# Altium schematic sheet Чертёж.SchDoc
size A4; SheetNumber: 1; SheetTotal: 1
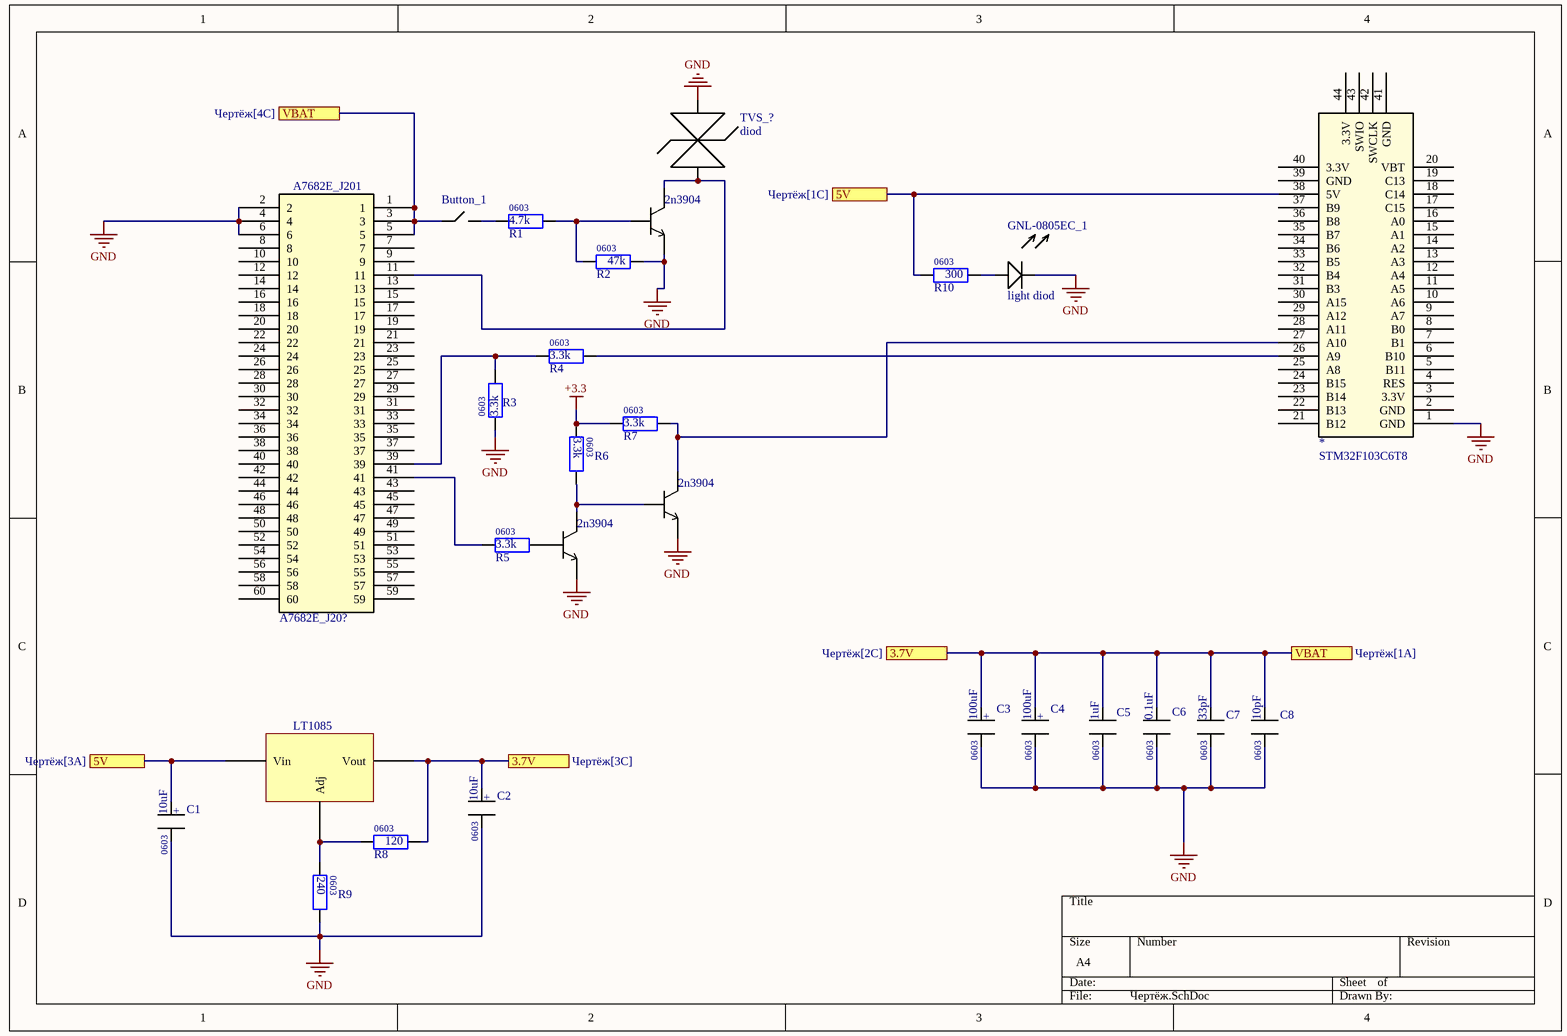
[diagram p0: Чертёж.SchDoc]

## Parts
2n3904_1  2n3904  (value not drawn)
2n3904_2  2n3904  (value not drawn)
2n3904_3  2n3904  (value not drawn)
*  STM32F103C6T8
A7682E_J201  A7682E_J20?
Button_1  Button  (value not drawn)
C1  capacitor  (value not drawn)
C2  capacitor  (value not drawn)
C3  capacitor  (value not drawn)
C4  capacitor  (value not drawn)
C5  capacitor  (value not drawn)
C6  capacitor  (value not drawn)
C7  CC060333pF  (value not drawn)
C8  capacitor  (value not drawn)
GNL-0805EC_1  light diod
LT1085_?  LT1085
R1  Resistor  (value not drawn)
R2  Resistor  (value not drawn)
R3  Resistor  (value not drawn)
R4  Resistor  (value not drawn)
R5  Resistor  (value not drawn)
R6  Resistor  (value not drawn)
R7  Resistor  (value not drawn)
R8  Resistor  (value not drawn)
R9  Resistor  (value not drawn)
R10  Resistor  (value not drawn)
TVS_?  diod

## Ports
3.7V (see Чертёж[2C]), 3.7V (see Чертёж[3C]), 5V (see Чертёж[1C]), 5V (see Чертёж[3A]), VBAT (see Чертёж[1A]), VBAT (see Чертёж[4C])

## Nets
+3.3: R6.0 R7.0
GND: 2n3904_1.6 2n3904_2.6 2n3904_3.6 *.1(GND) A7682E_J201.2 A7682E_J201.4 A7682E_J201.6 C1.3 C2.3 C3.3 C4.3 C5.3 C6.3 C7.3 C8.3 GNL-0805EC_1.?2 R2.1 R3.0 R9.1 TVS_?.?2
3.7V: A7682E_J201.1 A7682E_J201.3 A7682E_J201.5 Button_1.?1 C2.2 C3.2 C4.2 C5.2 C6.2 C7.2 C8.2 LT1085_?.?1(Vout) R8.1 ; port 3.7V, port VBAT
5V: *.38(5V) C1.2 LT1085_?.?3(Vin) R10.0 ; port 5V
Net2n3904_1_4: 2n3904_1.4 R1.1 R2.0
Net2n3904_1_5: 2n3904_1.5 A7682E_J201.11 TVS_?.?1
Net2n3904_2_4: 2n3904_2.4 R5.1
Net2n3904_2_5: 2n3904_2.5 2n3904_3.4 R6.1
Net2n3904_3_5: 2n3904_3.5 *.27(A10) R7.1
Net*_26: *.26(A9) R4.1
NetA7682E_J201_39: A7682E_J201.39 R3.1 R4.0
NetA7682E_J201_41: A7682E_J201.41 R5.0
NetButton_1_?2: Button_1.?2 R1.0
NetGNL-0805EC_1_?1: GNL-0805EC_1.?1 R10.1
NetLT1085_?_?2: LT1085_?.?2(Adj) R8.0 R9.0

Not connected (* = marked no-connect by the designer): * 2(GND) 3(3.3V) 4(RES) 5(B11) 6(B10) 7(B1) 8(B0) 9(A7) 10(A6) 11(A5) 12(A4) 13(A3) 14(A2) 15(A1) 16(A0) 17(C15) 18(C14) 19(C13) 20(VBT) 21(B12) 22(B13) 23(B14) 24(B15) 25(A8) 28(A11) 29(A12) 30(A15) 31(B3) 32(B4) 33(B5) 34(B6) 35(B7) 36(B8) 37(B9) 39(GND) 40(3.3V) 41(GND) 42(SWCLK) 43(SWIO) 44(3.3V); A7682E_J201 7 8 9 10 12 13 14 15 16 17 18 19 20 21 22 23 24 25 26 27 28 29 30 31 32 33 34 35 36 37 38 40 42 43 44 45 46 47 48 49 50 51 52 53 54 55 56 57 58 59 60

## Notes on the sheet
- (in symbol CC06030.1uF) 0603
- (in symbol CC06031uF) 0603
- (in symbol CC060310pF) 0603
- (in symbol CC060310uF) +; 0603
- (in symbol CC060333pF) 0603
- (in symbol CC0603100uF_1) +; 0603
- (in symbol CR0603_4,7kR) 0603; 4.7k
- (in symbol CR0603_47kR) 0603; 47k
- (in symbol CR06033.3kR) 0603; 3.3k
- (in symbol CR0603120R) 0603
- (in symbol CR0603240R) 0603
- (in symbol CR0603300R) 0603

## Library data of the parts
C1 C2 = CC060310uF: CC0603_10uF; Value: 10uF
C3 C4 = CC0603100uF_1: CC06003_100uF; Value: 100uF
C5 = CC06031uF: CC0603_1uF; Value: 1uF
C6 = CC06030.1uF: CC0603_0.1uF; Value: 0.1uF
C7 = CC060333pF: CC0603_33pF; Value: 33pF
C8 = CC060310pF: CC0603_10pF; Value: 10pF
GNL-0805EC_1 = GNL-0805EC
R1 = CR0603_4,7kR: Value: 1k
R2 = CR0603_47kR: Value: 1k
R3-R7 = CR06033.3kR: CR0603_3.3kR
R8 = CR0603120R: CR0603_120R; Value: 120
R9 = CR0603240R: CR0603_240R; Value: 240
R10 = CR0603300R: CR0603_300R; Value: 300
TVS_? = TVS_Diod: Value: 5V